# EAGLE schematic MotherBoard_v20 (EAGLE 9.7.0)
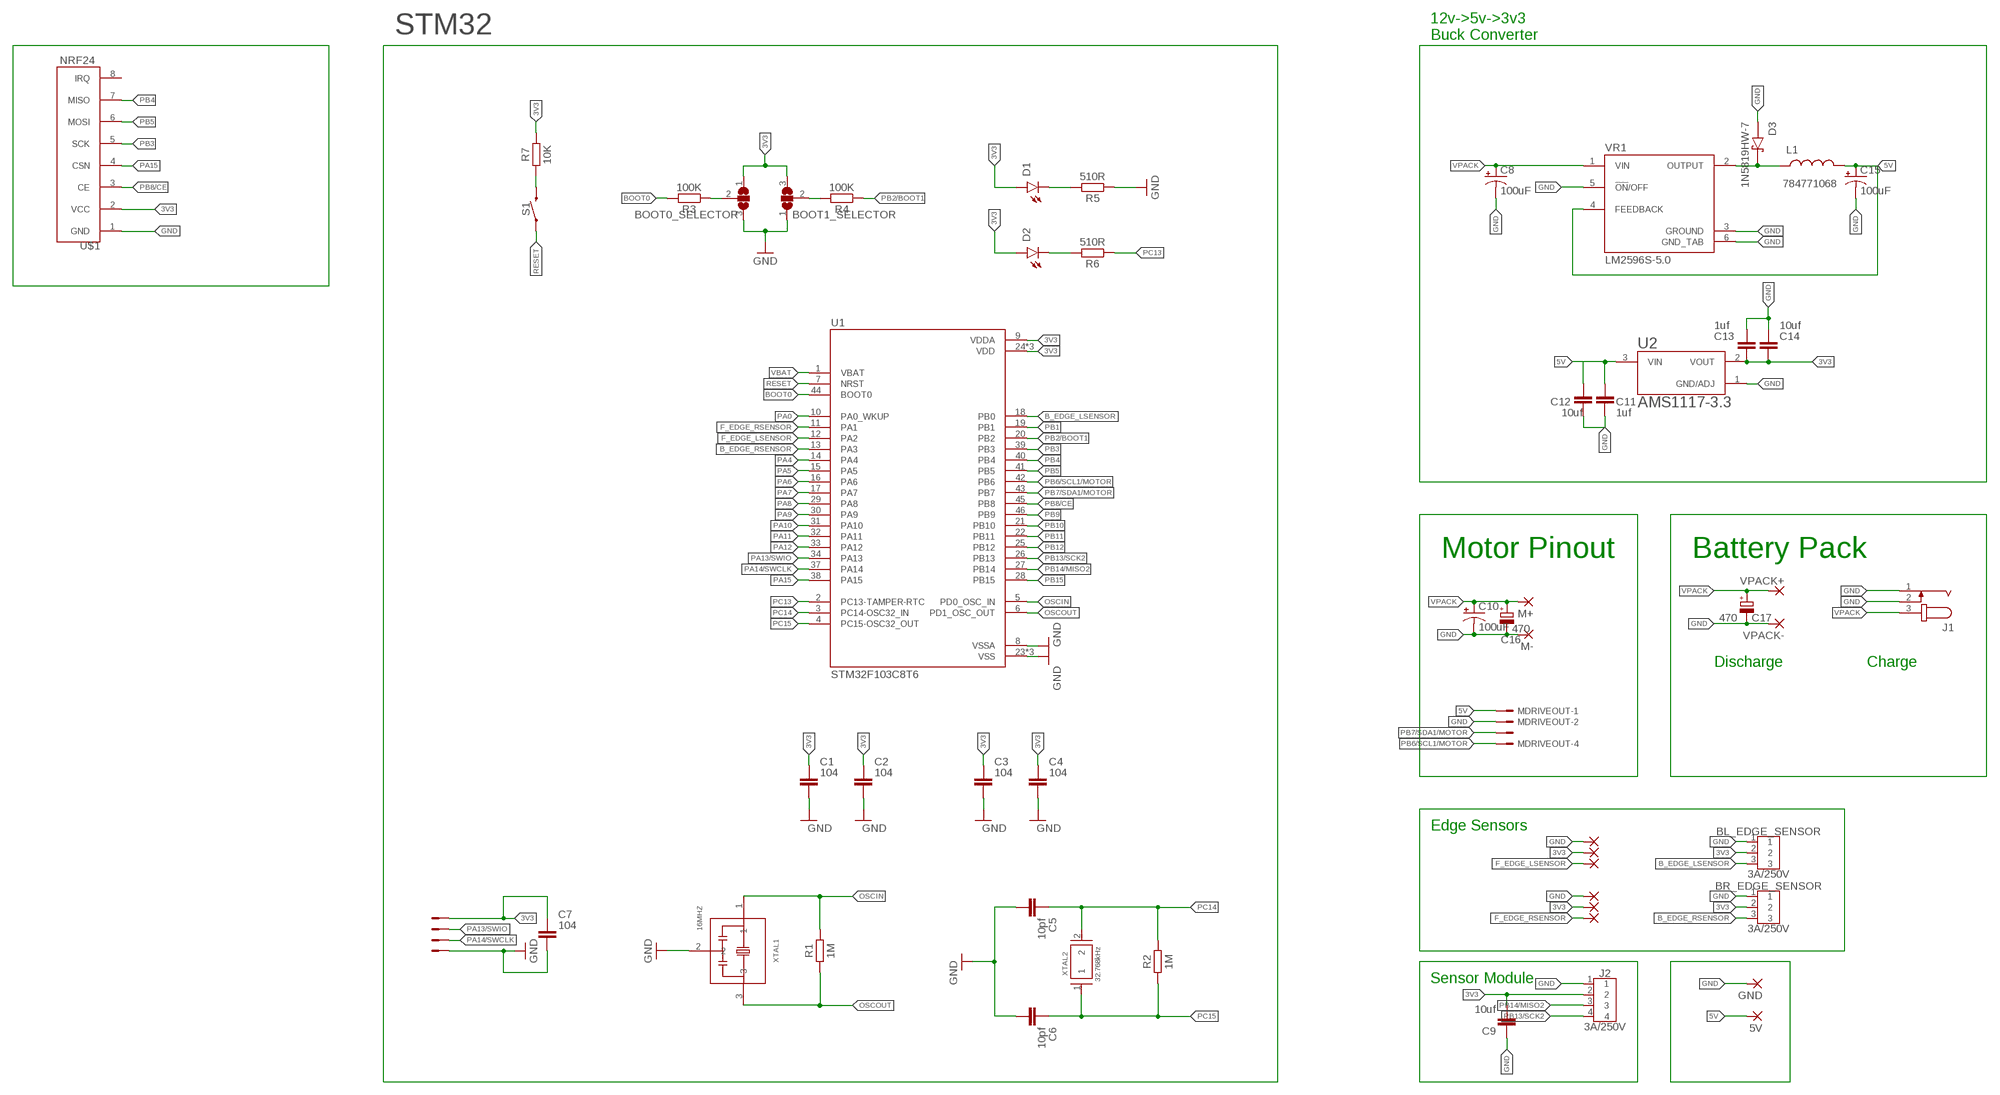
[diagram p0: schematic, sheet 1]

## Parts
5V  WIREPADSMD5-1,8  [5-1,8]
BL_EDGE_SENSOR  3A/250V  B3B-XH-A  [B3B-XH-A]
BOOT0_SELECTOR  SJ2W  [SJ_2]
BOOT1_SELECTOR  SJ2W  [SJ_2]
BR_EDGE_SENSOR  3A/250V  B3B-XH-A  [B3B-XH-A]
C1  104  C_CHIP-0603(1608-METRIC)  [CAPC1608X85]
C2  104  C_CHIP-0603(1608-METRIC)  [CAPC1608X85]
C3  104  C_CHIP-0603(1608-METRIC)  [CAPC1608X85]
C4  104  C_CHIP-0603(1608-METRIC)  [CAPC1608X85]
C5  10pf  C_CHIP-0603(1608-METRIC)  [CAPC1608X85]
C6  10pf  C_CHIP-0603(1608-METRIC)  [CAPC1608X85]
C7  104  C_CHIP-0603(1608-METRIC)  [CAPC1608X85]
C8  100uF  100UF-POLAR-25V-20%(ELEC)  [PANASONIC_D]
C9  10uf  C_CHIP-0603(1608-METRIC)  [CAPC1608X85]
C10  100uF  100UF-POLAR-25V-20%(ELEC)  [PANASONIC_D]
C11  1uf  C_CHIP-0603(1608-METRIC)  [CAPC1608X85]
C12  10uf  C_CHIP-0603(1608-METRIC)  [CAPC1608X85]
C13  1uf  C_CHIP-0603(1608-METRIC)  [CAPC1608X85]
C14  10uf  C_CHIP-0603(1608-METRIC)  [CAPC1608X85]
C15  100uF  100UF-POLAR-25V-20%(ELEC)  [PANASONIC_D]
C16  470  C-POL_RADIAL-11MM-DIA  [CAPPRD508W65D1000H1100B]
C17  470  C-POL_RADIAL-11MM-DIA  [CAPPRD508W65D1000H1100B]
D1  LED_GREEN  CHIP-ROUND-G_0805  [LEDC2012X105N_RND-G]
D2  LED_GREEN  CHIP-ROUND-G_0805  [LEDC2012X105N_RND-G]
D3  1N5819HW-7  [SOD3715X145N]
GND  WIREPADSMD5-1,8  [5-1,8]
J1  JACK-PLUG0  [SPC4077]
J2  3A/250V  B4B-XH-A  [B4B-XH-A]
J-LINK-CONNECTOR  SM04B-SSR-H-TB  [SM04B-SSR-H-TB]
L1  784771068  [784771068]
M+  WIREPADSMD5-1,8  [5-1,8]
M-  WIREPADSMD5-1,8  [5-1,8]
MDRIVEOUT  SM04B-SSR-H-TB  [SM04B-SSR-H-TB]
PAD1  SMD2  [SMD1,27-2,54]
PAD2  SMD2  [SMD1,27-2,54]
PAD3  SMD2  [SMD1,27-2,54]
PAD4  SMD2  [SMD1,27-2,54]
PAD5  SMD2  [SMD1,27-2,54]
PAD6  SMD2  [SMD1,27-2,54]
R1  1M  R_CHIP-0603(1608-METRIC)  [RESC1608X60]
R2  1M  R_CHIP-0603(1608-METRIC)  [RESC1608X60]
R3  100K  R_CHIP-0603(1608-METRIC)  [RESC1608X60]
R4  100K  R_CHIP-0603(1608-METRIC)  [RESC1608X60]
R5  510R  R_CHIP-0603(1608-METRIC)  [RESC1608X60]
R6  510R  R_CHIP-0603(1608-METRIC)  [RESC1608X60]
R7  10K  R_CHIP-0603(1608-METRIC)  [RESC1608X60]
S1  MOMENTARY-SWITCH-SPST-SMD-6.0X3.5MM  [TACTILE_SWITCH_SMD_6.0X3.5MM]
U1  STM32F103C8T6  [QFP50P900X900X160-48N]
U2  AMS1117-3.3  [SOT229P700X180-4N]
U$1  NRF24  [NRF24]
VPACK+  SMD5  [SMD2,54-5,08]
VPACK-  SMD5  [SMD2,54-5,08]
VR1  LM2596S-5.0  [TO170P1524X483-6N]
XTAL1  16MHZ  CSTCEFREQUENCY_16MHZ  [OSC_CSTCE8M00G55-R0]
XTAL2  32.768kHz  ABSO7  [XTAL_ABS07-32.768KHZ-T]

## Nets
3V3: BL_EDGE_SENSOR.2 BOOT0_SELECTOR.1 BOOT1_SELECTOR.3 BR_EDGE_SENSOR.2 C1.1 C2.1 C3.1 C4.1 C7.1 C9.2 C13.2 C14.2 D1.A D2.A J2.2 J-LINK-CONNECTOR.4 PAD2.1(P) PAD5.1(P) R7.2 U1.9(VDDA) U1.24(VDD) U1.36(VDD) U1.48(VDD) U2.2(VOUT) U$1.2(VCC)
5V: 5V.1(P) C11.1 C12.1 C15.+ L1.2 MDRIVEOUT.1 U2.3(VIN) VR1.4(FEEDBACK)
B00T1: BOOT1_SELECTOR.2 R4.2
B_EDGE_LSENSOR: BL_EDGE_SENSOR.3 U1.18(PB0)
B_EDGE_RSENSOR: BR_EDGE_SENSOR.3 U1.13(PA3)
BOOT0: R3.2 U1.44(BOOT0)
F_EDGE_LSENSOR: PAD3.1(P) U1.12(PA2)
F_EDGE_RSENSOR: PAD6.1(P) U1.11(PA1)
GND: BL_EDGE_SENSOR.1 BOOT0_SELECTOR.3 BOOT1_SELECTOR.1 BR_EDGE_SENSOR.1 C1.2 C2.2 C3.2 C4.2 C5.2 C6.2 C7.2 C8.- C9.1 C10.- C11.2 C12.2 C13.1 C14.1 C15.- C16.2(-) C17.2(-) D3.A GND.1(P) J1.1 J1.2 J2.1 J-LINK-CONNECTOR.1 M-.1(P) MDRIVEOUT.2 PAD1.1(P) PAD4.1(P) R5.1 U1.8(VSSA) U1.23(VSS) U1.35(VSS) U1.47(VSS) U2.1(GND/ADJ) U$1.1(GND) VPACK-.1(P) VR1.3(GROUND) VR1.5(!ON!/OFF) VR1.6(GND_TAB) XTAL1.2
N$1: D2.C R6.2
N$2: BOOT0_SELECTOR.2 R3.1
N$4: D1.C R5.2
N$5: R7.1 S1.2
OSCIN: R1.2 U1.5(PD0_OSC_IN) XTAL1.1
OSCOUT: R1.1 U1.6(PD1_OSC_OUT) XTAL1.3
PA0: U1.10(PA0_WKUP)
PA4: U1.14(PA4)
PA5: U1.15(PA5)
PA6: U1.16(PA6)
PA7: U1.17(PA7)
PA8: U1.29(PA8)
PA9: U1.30(PA9)
PA10: U1.31(PA10)
PA11: U1.32(PA11)
PA12: U1.33(PA12)
PA13/SWIO: J-LINK-CONNECTOR.3 U1.34(PA13)
PA14/SWCLK: J-LINK-CONNECTOR.2 U1.37(PA14)
PA15: U1.38(PA15) U$1.4(CSN)
PB1: U1.19(PB1)
PB2/BOOT1: R4.1 U1.20(PB2)
PB3: U1.39(PB3) U$1.5(SCK)
PB4: U1.40(PB4) U$1.7(MISO)
PB5: U1.41(PB5) U$1.6(MOSI)
PB6/SCL1/MOTOR: MDRIVEOUT.4 U1.42(PB6)
PB7/SDA1/MOTOR: MDRIVEOUT.3 U1.43(PB7)
PB8/CE: U1.45(PB8) U$1.3(CE)
PB9: U1.46(PB9)
PB10: U1.21(PB10)
PB11: U1.22(PB11)
PB12: U1.25(PB12)
PB13/SCK2: J2.4 U1.26(PB13)
PB14/MISO2: J2.3 U1.27(PB14)
PB15: U1.28(PB15)
PC13: R6.1 U1.2(PC13-TAMPER-RTC)
PC14: C5.1 R2.2 U1.3(PC14-OSC32_IN) XTAL2.2
PC15: C6.1 R2.1 U1.4(PC15-OSC32_OUT) XTAL2.1
RESET: S1.1 U1.7(NRST)
VBAT: U1.1(VBAT)
VOUT: D3.C(K) L1.1 VR1.2(OUTPUT)
VPACK: C8.+ C10.+ C16.1(+) C17.1(+) J1.3 M+.1(P) VPACK+.1(P) VR1.1(VIN)
Unconnected: U$1.8(IRQ)

## Notes on the sheet
- 12v->5v->3v3
  Buck Converter
- Motor Pinout | Battery Pack
- Discharge | Charge
- Edge Sensors
- Sensor Module

## Library data of the parts
5V GND M+ M- = wirepad:WIREPAD: Wire PAD connect wire on PCB
BL_EDGE_SENSOR BR_EDGE_SENSOR = Connector:B3B-XH-A: XH Connector Top Entry - 3POS Details see: Datasheet <http://www.jst-mfg.com/product/pdf/eng/eXH.pdf>; CATEGORY: CONNECTOR; DESCRIPTION: 2.5mm pitch/disconnectable crimp style connector; MANUFACTURER: JST (XH connector); MPN: B3B-XH-A; PART_STATUS: ACTIVE; ROHS_COMPLIANT: COMPLIANT; SERIES: B3B-XH-A; SPICEPREFIX: J; SUB_CATEGORY: THROUGH HOLE CONNECTOR; TYPE: SIDE ENTRY
BOOT0_SELECTOR BOOT1_SELECTOR = jumper:SJ2W: SMD solder JUMPER
C1-C7 C9 C11-C14 = Capacitor:C: Capacitor - Generic; CATEGORY: Capacitor
C8 C15 = SparkFun-Capacitors:100UF-POLAR: 100µF polarized capacitors A capacitor is a passive two-terminal electrical component used to store electrical energy temporarily in an electric field.; PROD_ID: CAP-12547; SPICEPREFIX: C
C10 = SparkFun-Capacitors:100UF-POLAR: 100µF polarized capacitors A capacitor is a passive two-terminal electrical component used to store electrical energy temporarily in an electric field.; PROD_ID: CAP-12547
C16 C17 = Capacitor:C-POL: Capacitor Polarised - Generic; CATEGORY: Capacitor
D1 D2 = LED:CHIP-ROUND-G; CATEGORY: LED; COLOR: GREEN; DESCRIPTION: CHIP LED ROUND; SUB-CATEGORY: CHIP; TYPE: ROUND_TOP
D3 = 1N5819HW-7.lbr.lbr:1N5819HW-7: 1N5819HW Series 40 V 1 A Surface Mount Schottky Barrier Rectifier - SOD-123 Check availability <https://pricing.snapeda.com/parts/1N5819HW-7/Diodes%20Inc./view-part?ref=eda>; AVAILABILITY: In Stock; DESCRIPTION: Diode Schottky 40 V 1A Surface Mount SOD-123; MF: Diodes Inc.; MP: 1N5819HW-7; PACKAGE: SOD-123 Fairchild Semiconductor; PRICE: None; PURCHASE-URL: https://pricing.snapeda.com/search/part/1N5819HW-7/?ref=eda; SPICEPREFIX: D
J1 = con-jack:JACK-PLUG: DC POWER JACK Power Jack, DC, Right Angle, Through Hole, Rated 5A at 16VDC, PC Terminals Distributor: Farnell (www.Farnell.de) Drawing: 84N1161.pdf / 84N1162.pdf Manufacturer: SPC Technology (www.spctechnology.com) Type: SPC4077 / SPC 4078; OC_FARNELL: unknown; OC_NEWARK: unknown
J2 = Connector:B4B-XH-A: XH Connector Top Entry - 4POS Details see: Datasheet <http://www.jst-mfg.com/product/pdf/eng/eXH.pdf>; CATEGORY: CONNECTOR; DSECRIPTION: 2.5mm pitch/disconnctable crimp style connector; MANUFACTURER: JST (XH connector); MPN: B4B-XH-A; OPERATING_TEMPERATURE: -25 C to 85 C; PART_STATUS: ACTIVE; ROHS_COMPLIANT: COMPLAINT; SERIES: B4B-XH-A; SUB_CATEGORY: Through hole; TYPE: TOP ENTRY
J-LINK-CONNECTOR MDRIVEOUT = con-jst2:SM04B-SSR-H-TB: Disconnectable Insulation displacement connector, 1.0mm pitch 4 contacts
L1 = Fixed Inductors:784771068: FIXED IND 6.8UH 5.5A 21.5 MOHM Manufacturer's datasheet <https://katalog.we-online.de/pbs/datasheet/784771068.pdf>; CREATED_BY: PCBLayout.com; DIGIKEY_PART_NUMBER: 732-6770-2-ND; MANUFACTURER: Wurth Electronics Inc.; MPN: 784771068; PACKAGE: 1260; SPICEPREFIX: L
PAD1-PAD6 = wirepad:SMD2: SMD PAD
R1-R7 = Resistor:R: Resistor Fixed - Generic; CATEGORY: Resistor; SUB-CATEGORY: Fixed
S1 = SparkFun-Switches:MOMENTARY-SWITCH-SPST: Momentary Switch (Pushbutton) - SPST Normally-open (NO) SPST momentary switches (buttons, pushbuttons). Variants PTH-12MM - 12mm square, through-hole Momentary Pushbutton Switch - 12mm Square <https://www.sparkfun.com/products/9190> (COM-09190) PTH-6.0MM, PTH-6.0MM-KIT - 6.0mm square, through-hole Mini Pushbutton Switch <https://www.sparkfun.com/products/97> (COM-00097) KIT package intended for soldering kit's - only one side of pads' copper is exposed. PTH-RIGHT-ANGLE-KIT - Right-angle, through-hole Right Angle Tactile Button <https://www.sparkfun.com/products/10791> - Used on SparkFun BigTime Watch Kit <https://www.sparkfun.com/products/11734> SMD-12MM - 12mm square, surface-mount Tactile Button - SMD (12mm) <https://www.sparkfun.com/products/12993> (COM-12993) Used on SparkFun PicoBoard <https://www.sparkfun.com/products/11888> SMD-4.5MM - 4.5mm Square Trackball Switch Used on SparkFun Blackberry Trackballer Breakout <https://www.sparkfun.com/products/13169> SMD-4.6MMX2.8MM - 4.60mm x 2.80mm, surface mount Used on SparkFun Pro Micro - RP2040 <https://www.sparkfun.com/products/17717> SMD-5.2MM, SMD-5.2-REDUNDANT - 5.2mm square, surface-mount Mini Pushbutton Switch - SMD <https://www.sparkfun.com/products/8720> (COM-08720) Used on Arduino Pro Mini <https://www.sparkfun.com/products/11114> REDUNDANT package connects both switch circuits together SMD-6.0X3.5MM - 6.0 x 3.5mm, surface mount Momentary Reset Switch SMD <https://www.sparkfun.com/products/8229> (COM-08229) SMD-6.2MM-TALL - 6.2mm square, surface mount Tactile Button - SMD (6mm) <https://www.sparkfun.com/products/12992> Used on SparkFun Digital Sandbox <https://www.sparkfun.com/products/12651> SMD-RIGHT-ANGLE - Right-angle, surface mount Used on SparkFun Block for Intel® Edison - Arduino <https://www.sparkfun.com/products/13036>; PROD_ID: SWCH-14278; SF_SKU: COM-08229
U1 = STM32F103C8T6:STM32F103C8T6: Mainstream Performance line, ARM Cortex-M3 MCU with 64 Kbytes Flash, 72 MHz CPU, motor control, USB and CAN Check availability <https://pricing.snapeda.com/parts/STM32F103C8T6/STMicroelectronics/view-part?ref=eda>; AVAILABILITY: In Stock; DESCRIPTION: ARM® Cortex®-M3 STM32F1 Microcontroller IC 32-Bit 72MHz 64KB (64K x 8) FLASH 48-LQFP (7x7); MF: STMicroelectronics; MP: STM32F103C8T6; PACKAGE: LQFP-48 STMicroelectronics; PRICE: None; PURCHASE-URL: https://pricing.snapeda.com/search/part/STM32F103C8T6/?ref=eda
U2 = AMS1117-3.3:AMS1117-3.3: Check availability <https://pricing.snapeda.com/parts/AMS1117-3.3/Advanced%20Monolithic%20Systems/view-part?ref=eda>; AVAILABILITY: Not in stock; DESCRIPTION: Sot223/Pkg 1-Amp 3.3-Volt Low Drop Out Voltage Regulatator; MF: Advanced Monolithic Systems; MP: AMS1117-3.3; PACKAGE: SOT-223 Seeed Technology; PRICE: None; SPICEPREFIX: U
U$1 = nrf24:NRF24
VPACK+ VPACK- = wirepad:SMD5: SMD PAD
VR1 = LM2596S-5.0:LM2596S-5.0: Check availability <https://pricing.snapeda.com/parts/LM2596S-5.0/Texas%20Instruments/view-part?ref=eda>; AVAILABILITY: In Stock; DESCRIPTION: SIMPLE SWITCHER&reg; 4.5V to 40V, 3A Low Component Count Step-Down Regulator 5-DDPAK/TO-263; MF: Texas Instruments; MP: LM2596S-5.0; PACKAGE: TO-263-5 Texas Instruments; PRICE: None; PURCHASE-URL: https://pricing.snapeda.com/search?q=LM2596S-5.0&ref=eda; SPICEPREFIX: X
XTAL1 = Frequency-Source:CSTCE: 8MHz Ceramic Resonator Built in Capacitor 33pF ±0.2% -20°C ~ 80°C Surface Mount Datasheet <https://www.murata.com/~/media/webrenewal/support/library/catalog/products/timingdevice/ceralock/p16e.ashx>; CATEGORY: Ceramic Resonator Built in Capacitor; MANUFACTURER: Murata Electronics; MPN: CSTCE16M0V53-R0; OPERATING_TEMPERATURE: -20°C ~ 80°C; PART_STATUS: ACTIVE; ROHS_COMPLIANT: COMPLIANT; SERIES: CSTCE; SUB_CATEGORY: CERAMIC RESONATOR; TYPE: Resonators
XTAL2 = Frequency-Source:ABSO7: CRYSTAL 32.7680KHZ 12.5PF SMD Datasheet <https://abracon.com/Resonators/ABS07.pdf>; CATEGORY: Crystal; MANUFACTURER: Abracon LLC; MPN: ABS07-32.768KHZ-T; OPERATING_TEMPERATURE: -40°C ~ 85°C; PART_STATUS: ACTIVE; ROHS_COMPLIANT: COMPLIANT; SERIES: ABS07; SUB_CATEGORY: Crystal Surface Mount; TYPE: Crystal